# EAGLE design IOB-Adapter-Input (EAGLE 7.7.0)

## Sheet 1 of 2
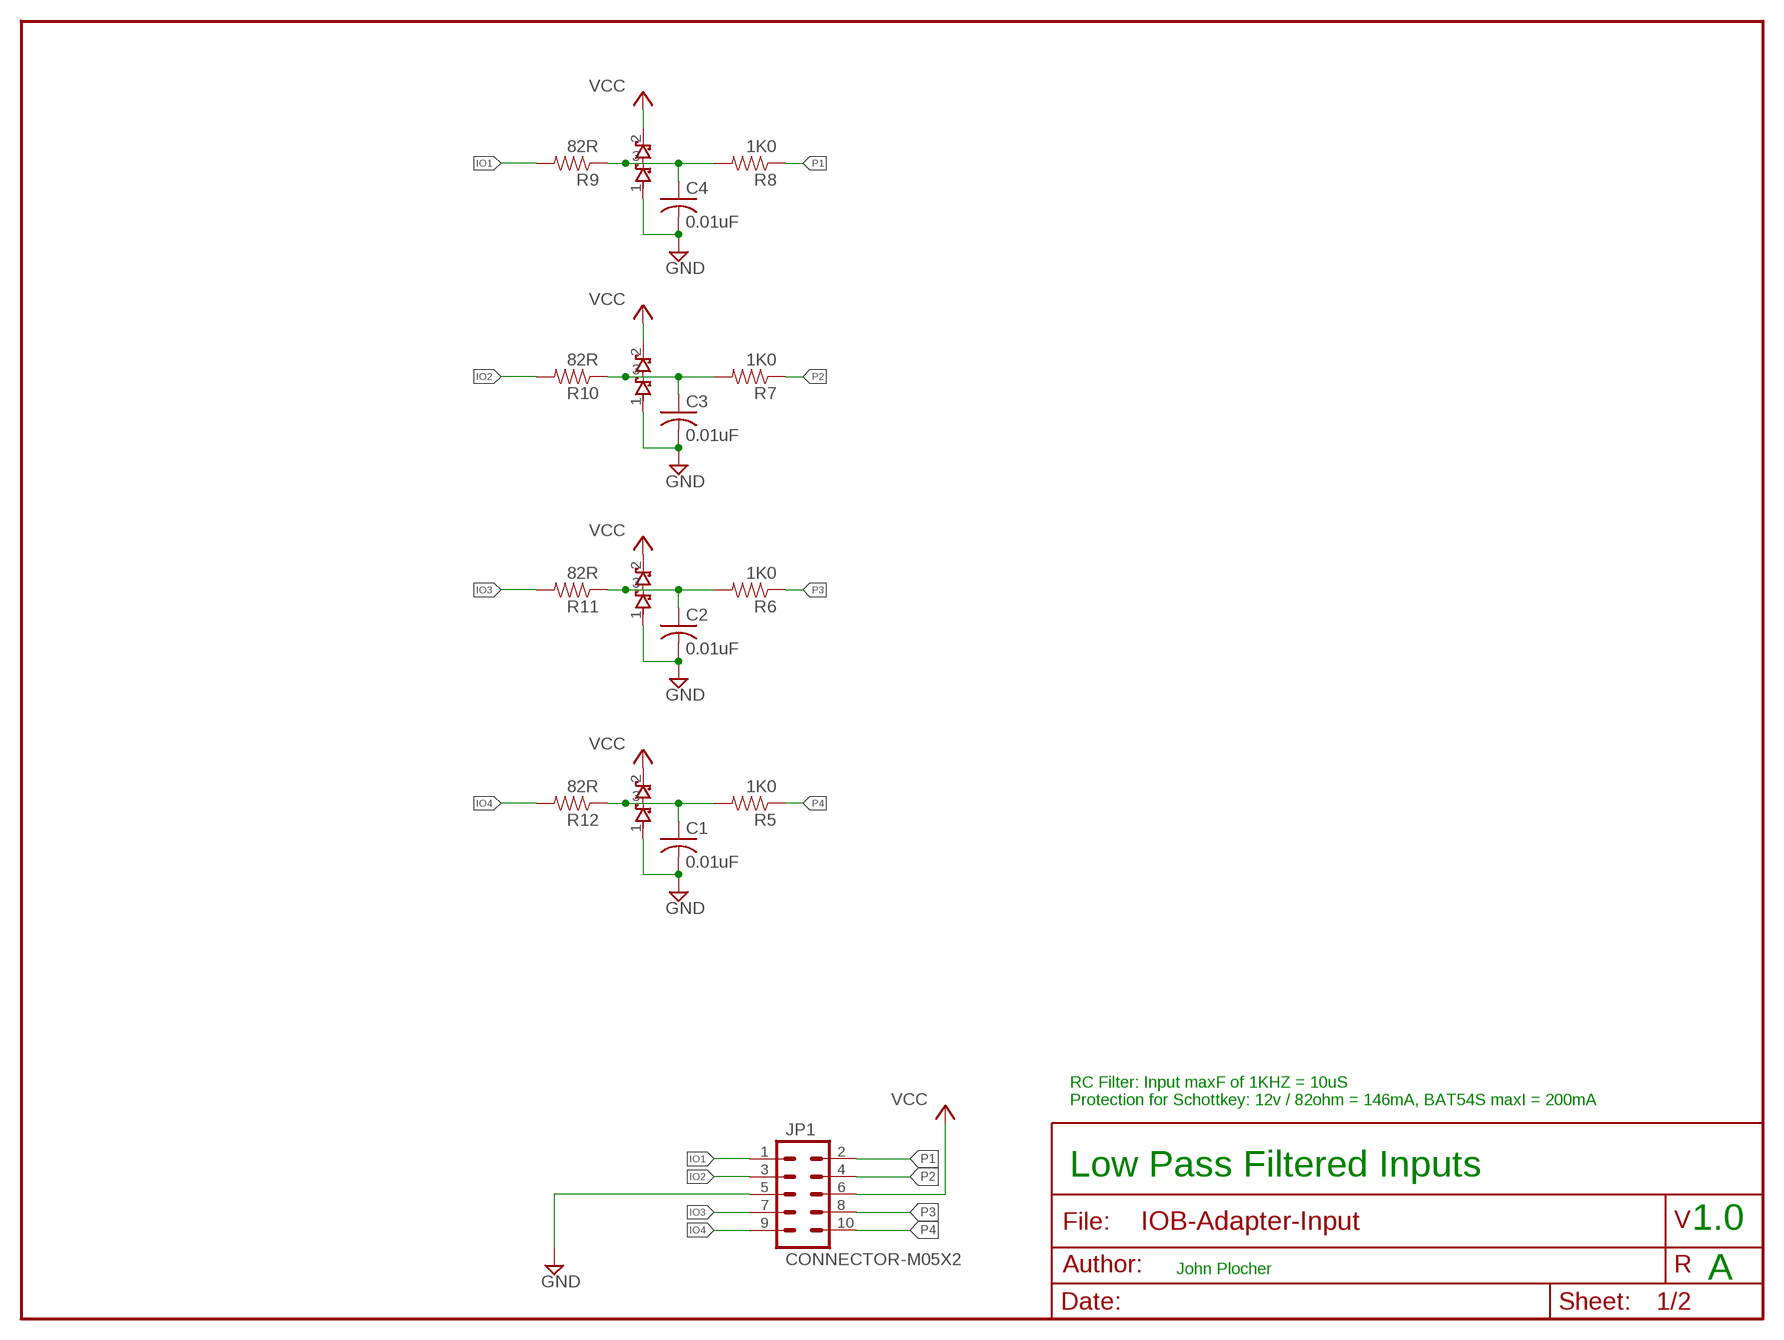
[diagram p0: schematic, sheet 1]

### Parts
C1  0.01uF  CAP0603  [0603-CAP]
C2  0.01uF  CAP0603  [0603-CAP]
C3  0.01uF  CAP0603  [0603-CAP]
C4  0.01uF  CAP0603  [0603-CAP]
D1  BAT54S  DIODE-BAT54S23  [SOT23]
D2  BAT54S  DIODE-BAT54S23  [SOT23]
D3  BAT54S  DIODE-BAT54S23  [SOT23]
D4  BAT54S  DIODE-BAT54S23  [SOT23]
JP1  CONNECTOR-M05X2  [IOB-V3-MODULE]
R5  1K0  R0603-RES  [0603-RES]
R6  1K0  R0603-RES  [0603-RES]
R7  1K0  R0603-RES  [0603-RES]
R8  1K0  R0603-RES  [0603-RES]
R9  82R  R0805-RES  [0805-RES]
R10  82R  R0805-RES  [0805-RES]
R11  82R  R0805-RES  [0805-RES]
R12  82R  R0805-RES  [0805-RES]

### Nets
GND [Power]: C1.2 C2.2 C3.2 C4.2 D1.1(A1) D2.1(A1) D3.1(A1) D4.1(A1) JP1.5
IO1 [signals]: JP1.1 R9.2
IO2 [signals]: JP1.3 R10.2
IO3 [signals]: JP1.7 R11.2
IO4 [signals]: JP1.9 R12.2
N$10: C1.1 D1.3(COM) R5.2 R12.1
N$12: C2.1 D2.3(COM) R6.2 R11.1
N$13: C3.1 D3.3(COM) R7.2 R10.1
N$14: C4.1 D4.3(COM) R8.2 R9.1
P1 [signals]: JP1.2 R8.1
P2 [signals]: JP1.4 R7.1
P3 [signals]: JP1.8 R6.1
P4 [signals]: JP1.10 R5.1
VCC [Power]: D1.2(C2) D2.2(C2) D3.2(C2) D4.2(C2) JP1.6

### Notes on the sheet
- RC Filter: Input maxF of 1KHZ = 10uS
  Protection for Schottkey: 12v / 82ohm = 146mA, BAT54S maxI = 200mA
- Low Pass Filtered Inputs
- 1.0
- John Plocher
- A

## Sheet 2 of 2
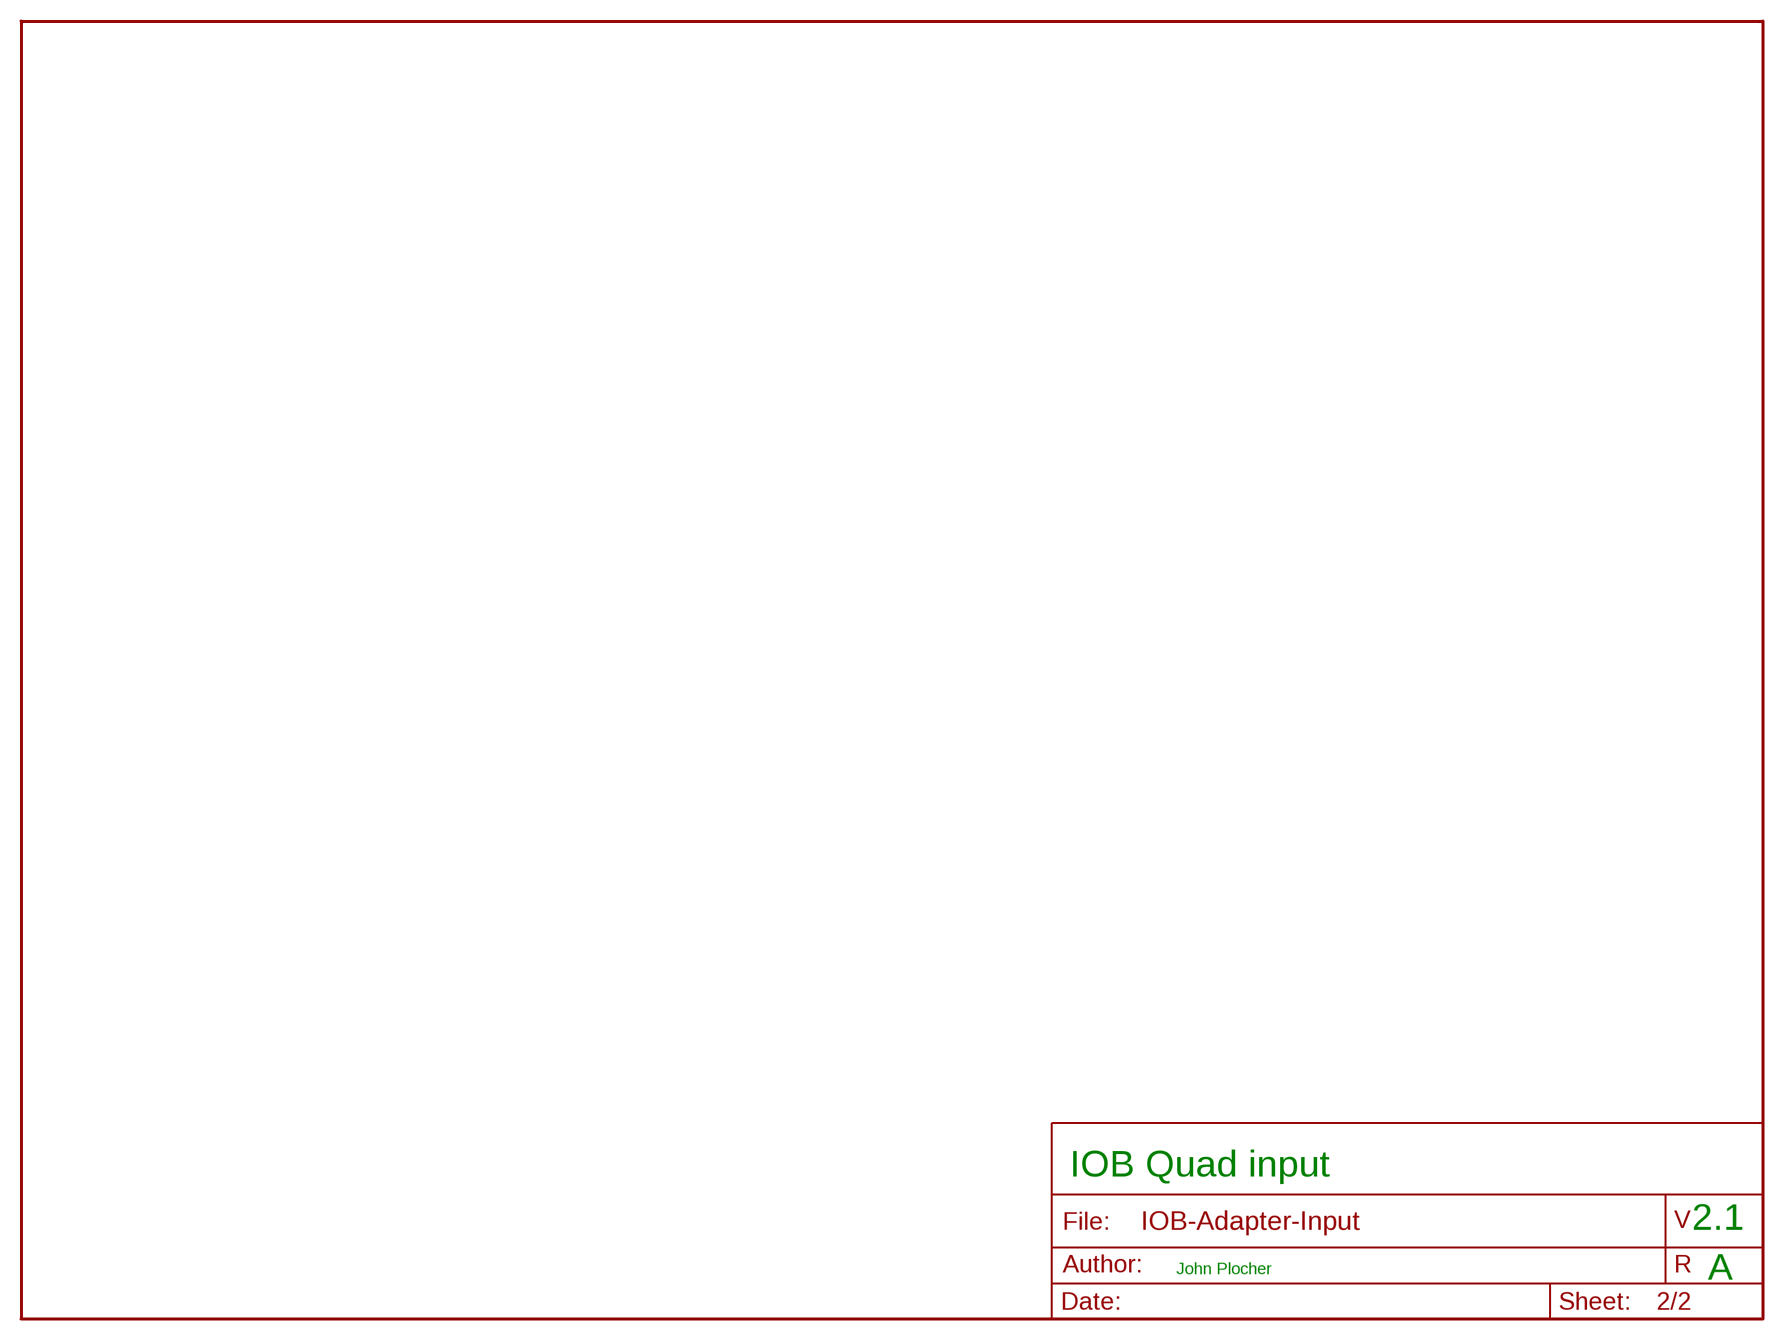
[diagram p1: schematic, sheet 2]

### Notes on the sheet
- IOB Quad input
- 2.1
- John Plocher
- A

## Library data of the parts
C1-C4 = SPCoast:CAP*
D1-D4 = SPCoast:DIODE-BAT54S
JP1 = SPCoast:CONNECTOR-M05X2: Header 5x2 Standard 10-pin dual row 0.1" header. Commonly used with AVR-ISP. Use with Spark Fun Electronics SKU: PRT-00778
R5-R12 = SPCoast:R*: Resistor Basic schematic elements and footprints for 0603, 1206, and PTH 1/10th watt (small) resistors.

## Net classes
0 default: width 0.254 mm, drill 0.4 mm, clearance 0.127 mm
1 Power: width 0.254 mm, drill 0.4 mm, clearance 0.127 mm
2 signals: width 0.254 mm, drill 0.4 mm, clearance 0.127 mm

## Board
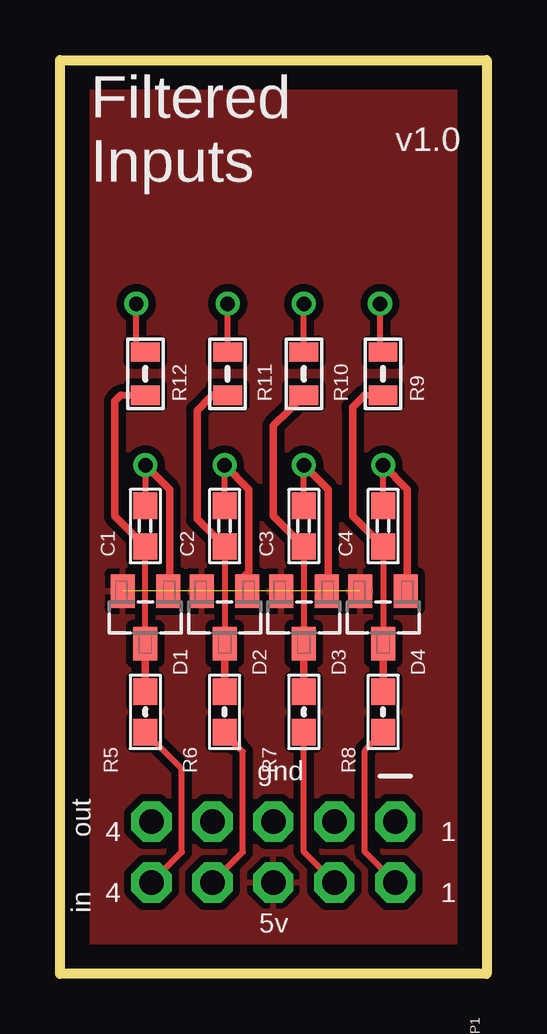
[diagram p2: board, top side]
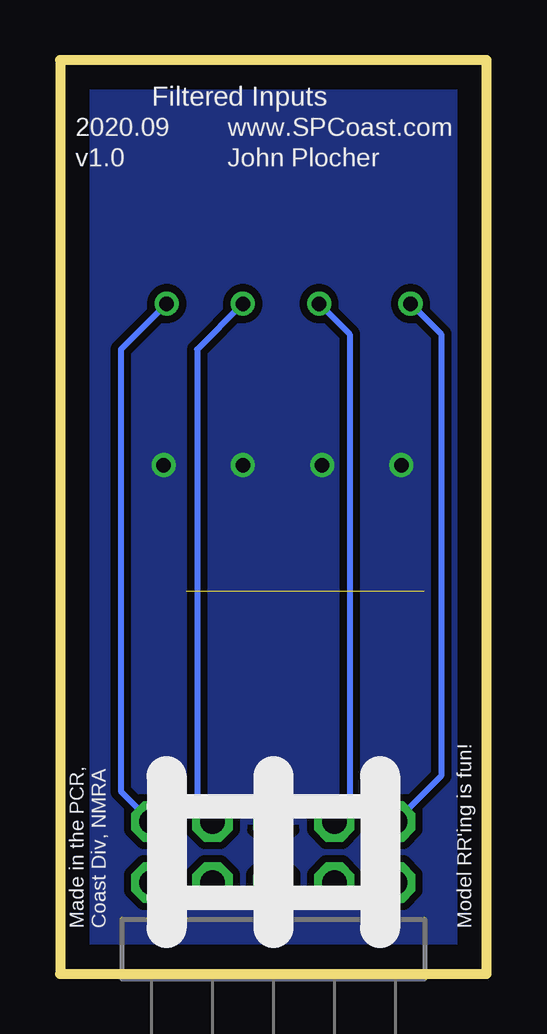
[diagram p3: board, bottom side, seen from below]

Size 17.78 x 38.1 mm. Coordinates in mm from the lower left corner, seen from the top.
Outline: 0,38.1 17.78,38.1 17.78,0 0,0 0,38.1
Copper layers (1*16): Top 0.035mm / dielectric 1.5mm / Bottom 0.035mm
Design rules "default": minimum track width 10mil, minimum drill 0.6mm, track to track 8mil, track to pad 8mil, pad to pad 8mil, via to via 8mil, smd to smd 8mil, copper to edge 40mil, drill to drill 8mil, minimum pad ring 10mil, minimum via ring 8mil, stop-mask expansion 4mil, vias tented up to drill 0mil, thermal gap 10mil

### Footprints (pad centres in the part's own frame; a part is rotated, then mirrored left to right if it is on the bottom)
0603-CAP = smd 1.1 x 1: 1 -0.85,0; 2 0.85,0
SOT23 = smd 1.4 x 1: 1 1.1,-0.95; 2 1.1,0.95; 3 -1.1,0
IOB-V3-MODULE = drill 1.016 pad 1.676 octagon: 1 -1.27,-5.08; 2 1.27,-5.08; 3 -1.27,-2.54; 4 1.27,-2.54; 5 -1.27,0; 6 1.27,0; 7 -1.27,2.54; 8 1.27,2.54; 9 -1.27,5.08; 10 1.27,5.08
0603-RES = smd 1.1 x 1: 1 -0.85,0; 2 0.85,0
0805-RES = smd 0.8 x 1.2: 1 -0.9,0; 2 0.9,0

### Placement (x,y rotation side)
C1  3.56,18.67 90 top
C2  6.86,18.67 90 top
C3  10.16,18.67 90 top
C4  13.46,18.67 90 top
D1  3.56,14.86 90 top
D2  6.86,14.86 90 top
D3  10.16,14.86 90 top
D4  13.46,14.86 90 top
JP1  8.89,5.08 270 bottom
R5  3.56,10.92 90 top
R6  6.86,10.92 90 top
R7  10.16,10.92 90 top
R8  13.46,10.92 90 top
R9  13.46,25.02 90 top
R10  10.16,25.02 90 top
R11  6.99,25.02 90 top
R12  3.56,25.02 90 top

### Tracks (layer width: path | path; a pad name or v marks a point on that pad's centre or on a via)
GND  (via drill 0.6)
  Top 0.254: C4.2 v13.46,21.21 | v3.56,21.21 C1.2 | C2.2 v6.86,21.21 | C3.2 v10.16,21.21
  Top 0.305: D1.1 4.21,16.27 4.57,16.64 4.57,20.19 v3.56,21.21 | D2.1 7.51,16.4 7.87,16.76 7.87,20.19 v6.86,21.21 | D3.1 10.81,16.27 11.18,16.64 11.18,20.19 v10.16,21.21 | D4.1 14.11,16.27 14.48,16.64 14.48,20.19 v13.46,21.21
  pour Bottom (isolate 0.305): 0.38,0.38 0.38,37.72 17.4,37.72 17.4,0.38
IO1  (via drill 0.6)
  Top 0.254: R9.2 13.34,26.05 v13.34,27.94
  Bottom 0.254: v13.34,27.94 15.24,26.04 15.24,7.62 JP1.1
IO2  (via drill 0.6)
  Top 0.254: R10.2 v10.16,27.94
  Bottom 0.254: v10.16,27.94 12.06,26.04 12.06,6.99 JP1.3
IO3  (via drill 0.6)
  Top 0.254: R11.2 v6.99,27.94
  Bottom 0.254: v6.99,27.94 5.71,26.67 5.71,6.99 JP1.7
IO4  (via drill 0.6)
  Top 0.254: R12.2 3.17,26.3 v3.17,27.94
  Bottom 0.254: v3.17,27.94 1.91,26.67 1.91,8.26 JP1.9
N$10
  Top 0.254: D1.3 C1.1
  Top 0.305: D1.3 R5.2 | R12.1 2.54,24.13 2.29,23.88 2.29,19.09 C1.1
N$12
  Top 0.254: C2.1 D2.3
  Top 0.305: D2.3 R6.2 | R11.1 6.35,24.13 5.71,23.5 5.71,18.96 C2.1
N$13
  Top 0.254: C3.1 D3.3
  Top 0.305: D3.3 R7.2 | R10.1 9.53,23.5 8.89,22.86 8.89,19.09 C3.1
N$14
  Top 0.254: C4.1 D4.3
  Top 0.305: D4.3 R8.2 | R9.1 12.7,24.13 12.19,23.62 12.19,19.09 C4.1
P1
  Top 0.254: JP1.2 12.7,5.08 12.7,9.31 R8.1
P2
  Top 0.254: JP1.4 10.16,5.08 R7.1
  Top 0.305: R7.1 9.91,9.77
P3
  Top 0.254: JP1.8 7.62,5.08 7.62,9.26 7.37,9.51
  Top 0.305: R6.1 7.37,9.51
P4
  Top 0.254: JP1.10 5.08,5.08 5.08,8.55 R5.1
VCC  (3 unrouted)
  pour Top (isolate 0.305): 0.38,0.38 0.38,37.72 17.4,37.72 17.4,0.38

### Text on the board
tPlace: v1.0 | Filtered / Inputs
bPlace: Filtered Inputs | www.SPCoast.com | 2020.09 | John Plocher | v1.0 | Model RR'ing is fun! | Made in the PCR, / Coast Div, NMRA
Document: Red
_tNames: R1 | R2 | R3 | R4 | C1 | C2 | C3 | C4 | D1 | D2 | D3 | D4 | R5 | R6 | R7 | R8 | JP1